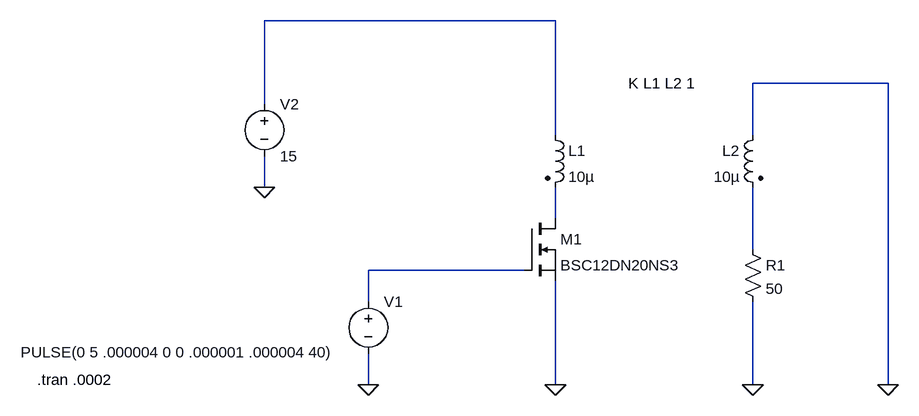
[diagram p0: schematic basic-xfmr.asc]
basic-xfmr.asc, the LTspice schematic file:
Version 4
SHEET 1 972 680
WIRE 288 -288 -160 -288
WIRE 800 -192 592 -192
WIRE -160 -160 -160 -288
WIRE 288 -112 288 -288
WIRE 592 -112 592 -192
WIRE -160 -32 -160 -80
WIRE 288 16 288 -32
WIRE 592 64 592 -32
WIRE 240 96 0 96
WIRE 0 144 0 96
WIRE 0 272 0 224
WIRE 288 272 288 112
WIRE 592 272 592 144
WIRE 800 272 800 -192
FLAG 0 272 0
FLAG 288 272 0
FLAG -160 -32 0
FLAG 592 272 0
FLAG 800 272 0
SYMBOL voltage 0 128 R0
WINDOW 3 -49 94 Right 2
WINDOW 123 0 0 Left 2
WINDOW 39 0 0 Left 2
SYMATTR InstName V1
SYMATTR Value PULSE(0 5 .000004 0 0 .000001 .000004 40)
SYMBOL ind2 272 -128 R0
SYMATTR InstName L1
SYMATTR Value 10µ
SYMATTR Type ind
SYMBOL nmos 240 16 R0
SYMATTR InstName M1
SYMATTR Value BSC12DN20NS3
SYMBOL voltage -160 -176 R0
WINDOW 123 0 0 Left 2
WINDOW 39 0 0 Left 2
SYMATTR InstName V2
SYMATTR Value 15
SYMBOL res 576 48 R0
SYMATTR InstName R1
SYMATTR Value 50
SYMBOL ind2 608 -128 M0
SYMATTR InstName L2
SYMATTR Value 10µ
SYMATTR Type ind
TEXT -510 264 Left 2 !.tran .0002
TEXT 400 -192 Left 2 !K L1 L2 1

The netlist it stands for:
* basic-xfmr.asc
V1 N004 0 PULSE(0 5 .000004 0 0 .000001 .000004 40)
L1 N001 N002 10µ
M1 N002 N004 0 0 BSC12DN20NS3
V2 N001 0 15
R1 N003 0 50
L2 0 N003 10µ
.model NMOS NMOS
.model PMOS PMOS
.lib standard.mos
.tran .0002
K L1 L2 1
.backanno
.end